# Altium project ERN_MainPower.PrjPcb
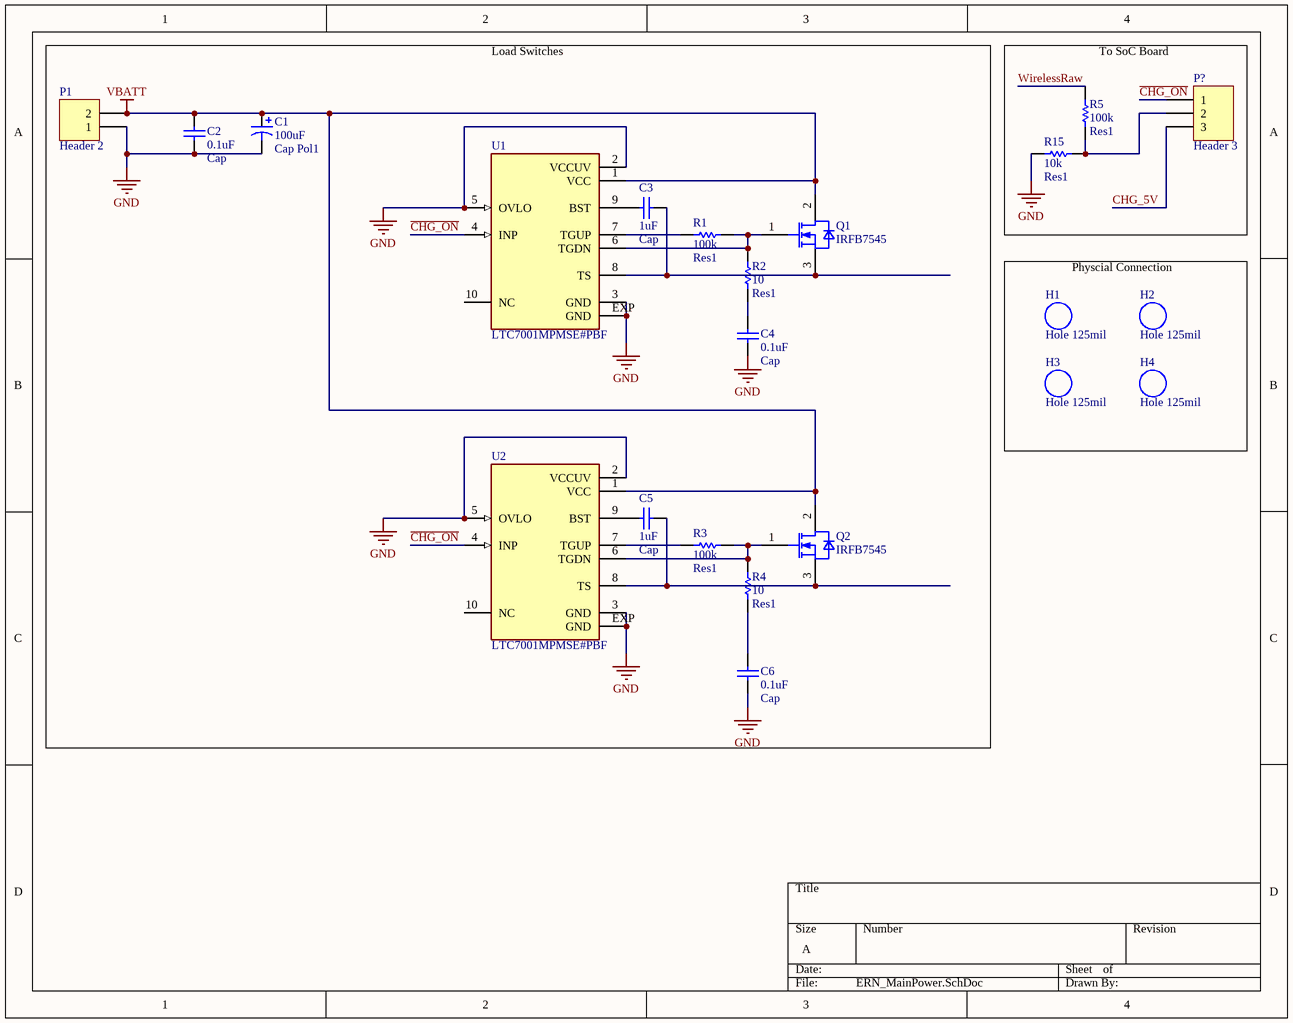
[diagram p0: ERN_MainPower.SchDoc]
2 sheets, 67 parts. Net scope: global (net labels, ports and power ports of the same name join across sheets).
Board file: ERN_MainPower.PcbDoc
Sheets:
  ERN_MainPower.SchDoc
  ERN_MainPower_2.SchDoc

## Sheet ERN_MainPower.SchDoc
size A; SheetNumber: 1; SheetTotal: 2; SPICEModelCachePHLGHTKS: <root> / <DocumentId>PHLGHTKS</DocumentId> / </root>

### Parts
C1  Cap Pol1  value 100uF  [RB7.6-15]
C2  Cap  value 0.1uF  [RAD-0.3]
C3  Cap  value 1uF  [C0805]
C4  Cap  value 0.1uF  [C0805]
C5  Cap  value 1uF  [C0805]
C6  Cap  value 0.1uF  [C0805]
H1  Hole 125mil  [Hole 125mil]
H2  Hole 125mil  [Hole 125mil]
H3  Hole 125mil  [Hole 125mil]
H4  Hole 125mil  [Hole 125mil]
P1  Header 2  [HDR1X2]
P?  Header 3  [HDR1X3]
Q1  IRFB7545  [IFX-PG-TO220-3-904]
Q2  IRFB7545  [IFX-PG-TO220-3-904]
R1  Res1  value 100k  [AXIAL-0.3]
R2  Res1  value 10  [AXIAL-0.3]
R3  Res1  value 100k  [AXIAL-0.3]
R4  Res1  value 10  [AXIAL-0.3]
R5  Res1  value 100k  [AXIAL-0.3]
R15  Res1  value 10k  [AXIAL-0.3]
U1  LTC7001MPMSE#PBF  [SOP50P490X110-11N]
U2  LTC7001MPMSE#PBF  [SOP50P490X110-11N]

### Blocks framed on the sheet
Load Switches: C1-C6 P1 Q1 Q2 R1-R4 U1 U2
To SoC Board: P? R5 R15
Physcial Connection: H1-H4

### Nets
GND: C1.2 C2.1 C4.2 C6.2 P1.1 R15.2 U1.2(VCCUV) U1.3(GND) U1.5(OVLO) U1.EXP(GND) U2.2(VCCUV) U2.3(GND) U2.5(OVLO) U2.EXP(GND)
VBATT: C1.1 C2.2 P1.2 Q1.2(DRAIN) Q2.2(DRAIN) U1.1(VCC) U2.1(VCC)
~{CHG_ON}: P?.1 U1.4(INP) U2.4(INP)
CHG_5V: P?.3
WirelessRaw: R5.1
NetC3_1: C3.1 Q1.3(SOURCE) U1.8(TS)
NetC3_2: C3.2 U1.9(BST)
NetC4_1: C4.1 R2.2
NetC5_1: C5.1 Q2.3(SOURCE) U2.8(TS)
NetC5_2: C5.2 U2.9(BST)
NetC6_1: C6.1 R4.2
NetP?_2: P?.2 R5.2 R15.1
NetQ1_1: Q1.1(GATE) R1.1 R2.1 U1.6(TGDN)
NetQ2_1: Q2.1(GATE) R3.1 R4.1 U2.6(TGDN)
NetR1_2: R1.2 U1.7(TGUP)
NetR3_2: R3.2 U2.7(TGUP)

Not connected (* = marked no-connect by the designer): U1 10(NC); U2 10(NC)

### Library data of the parts
C1 = Cap Pol1: Polarized Capacitor (Radial); Published: 8-Jun-2000; LatestRevisionDate: 17-Jul-2002; LatestRevisionNote: Re-released for DXP Platform.; PackageReference: RB7.6-15; Publisher: Altium Limited; PackageDescription: Polarized Capacitor (Radial); 2 Leads
C2-C6 = Cap: Capacitor; Published: 8-Jun-2000; LatestRevisionDate: 17-Jul-2002; LatestRevisionNote: Re-released for DXP Platform.; PackageReference: RAD-0.3; Publisher: Altium Limited; PackageDescription: Radial Cap, Thru-Hole; 2 Leads; 0.3 in Pin Spacing
P1 = Header 2: Header, 2-Pin; LatestRevisionDate: 17-Jul-2002; LatestRevisionNote: Re-released for DXP Platform.; Publisher: Altium Limited
P? = Header 3: Header, 3-Pin; LatestRevisionDate: 17-Jul-2002; LatestRevisionNote: Re-released for DXP Platform.; Publisher: Altium Limited
Q1 Q2 = IRFB7545: N-Channel 60V 95A; Insulated-Gate Field-Effect Transistor (IGFET), N-Channel, Enhancement, Body Diode, Pin 1 Gate, 2 Drain, 3 Source, 3 Pins; Manufacturer: Infineon Technologies; Manufacturer Order Number: IRFB7545; PackageReference: PG-TO220-3-904
R1-R5 R15 = Res1: Resistor; Published: 8-Jun-2000; LatestRevisionDate: 17-Jul-2002; LatestRevisionNote: Re-released for DXP Platform.; PackageReference: AXIAL-0.3; Publisher: Altium Limited; PackageDescription: Axial Device, Thru-Hole; 2 Leads; 0.3 in Pin Spacing
U1 U2 = LTC7001MPMSE#PBF: Fast 150V High Side NMOS Static Switch Driver; MF: Analog Devices; SnapEDA_Link: https://www.snapeda.com/parts/LTC7001MPMSE%23PBF/Analog+Devices/view-part/?ref=snap; Package: MSOP -10 Analog Devices; Value: *; MP: LTC7001MPMSE#PBF; Check_prices: https://www.snapeda.com/parts/LTC7001MPMSE%23PBF/Analog+Devices/view-part/?ref=eda

## Sheet ERN_MainPower_2.SchDoc
size A; SheetNumber: 2; SheetTotal: 2; SPICEModelCacheXCFOMGVR: <root> / <DocumentId>XCFOMGVR</DocumentId> / <CacheFrame Number="0"> / <Model Name="1n5400" Kind="MDL"> / <Text>*1N5400 MCE / * 50V 3A Si Rectifier pkg:DO-201 1,2 / .MODEL 1N5400 D(IS=2.68E-12 RS=0.00977 N=1.17 TT=1.44E-5 CJO=1.24E-10 / + VJ=0.6 M=0.333 BV=66.6 IBV=1E-5 )</Text> / </Model> / <Model Name="led2" Kind="MDL"> / <Text>*Typ RED,GREEN,YELLOW,AMBER GaAs LED: Vf=2.1V Vr=4V If=40mA trr=3uS / *LED Pinout: 1=A, 2=K / .MODEL LED2 D (IS=93.1P RS=42M N=4.61 BV=4 IBV=10U / + CJO=2.97P VJ=.75 M=.333 TT=4.32U)</Text> / </Model> / <Model Name="diode" Kind="MDL"> / <Text>*Default Diode / *Diode Pinout: A,K / .MODEL DIODE D()</Text> / </Model> / <Model Name="1n5406" Kind="MDL"> / <Text>*1N5406 MCE / *600V 3A Si Rectifier pkg:DO-201 1,2 / .MODEL 1N5406 D(IS=2.68E-12 RS=0.00731 N=1.17 TT=1.44E-5 CJO=1.24E-10 / + VJ=0.6 M=0.333 BV=900 IBV=1E-5 )</Text> / </Model> / </CacheFrame> / </root>
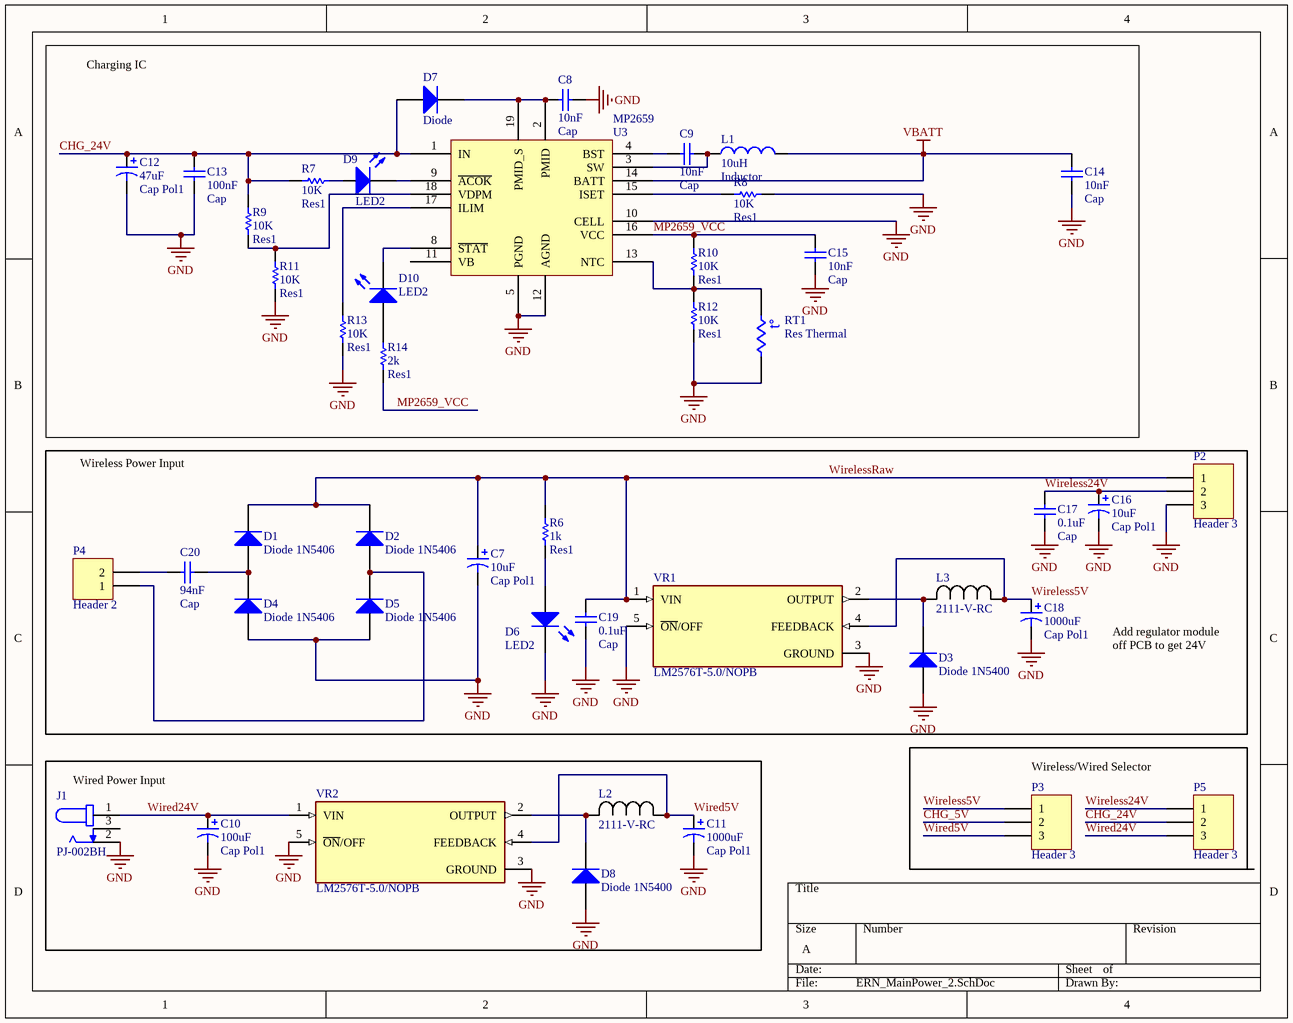
[diagram p1: ERN_MainPower_2.SchDoc]

### Parts
C7  Cap Pol1  value 10uF  [RB7.6-15]
C8  Cap  value 10nF  [C0805]
C9  Cap  value 10nF  [C0805]
C10  Cap Pol1  value 100uF  [RB7.6-15]
C11  Cap Pol1  value 1000uF  [RB7.6-15]
C12  Cap Pol1  value 47uF  [RB7.6-15]
C13  Cap  value 100nF  [RAD-0.3]
C14  Cap  value 10nF  [C0805]
C15  Cap  value 10nF  [C0805]
C16  Cap Pol1  value 10uF  [RB7.6-15]
C17  Cap  value 0.1uF  [RAD-0.3]
C18  Cap Pol1  value 1000uF  [RB7.6-15]
C19  Cap  value 0.1uF  [RAD-0.3]
C20  Cap  value 94nF  [C1210]
D1  Diode 1N5406  [DO-201AD]
D2  Diode 1N5406  [DO-201AD]
D3  Diode 1N5400  [DO-201AD]
D4  Diode 1N5406  [DO-201AD]
D5  Diode 1N5406  [DO-201AD]
D6  LED2  [3.2X1.6X1.1]
D7  Diode  [DIODE_SMC]
D8  Diode 1N5400  [DO-201AD]
D9  LED2  [LED-0]
D10  LED2  [LED-0]
J1  PJ-002BH  [CUI_PJ-002BH]
L1  Inductor  value 10uH  [0402-A]
L2  2111-V-RC  [IND_21XX_27A_V]
L3  2111-V-RC  [IND_21XX_27A_V]
P2  Header 3  [HDR1X3]
P3  Header 3  [HDR1X3]
P4  Header 2  [HDR1X2]
P5  Header 3  [HDR1X3]
R6  Res1  value 1k  [AXIAL-0.3]
R7  Res1  value 10K  [AXIAL-0.3]
R8  Res1  value 10K  [AXIAL-0.3]
R9  Res1  value 10K  [AXIAL-0.3]
R10  Res1  value 10K  [AXIAL-0.3]
R11  Res1  value 10K  [AXIAL-0.3]
R12  Res1  value 10K  [AXIAL-0.3]
R13  Res1  value 10K  [AXIAL-0.3]
R14  Res1  value 2k  [AXIAL-0.3]
RT1  Res Thermal  [AXIAL-0.3]
U3  MP2659  [MP2659_QFN19]
VR1  LM2576T-5.0/NOPB  [TO170P1067X483X1651-5]
VR2  LM2576T-5.0/NOPB  [TO170P1067X483X1651-5]

### Blocks framed on the sheet
Charging IC: C8 C9 C12-C15 D7 D9 D10 L1 R7-R14 RT1 U3
Wired Power Input: C10 C11 D8 J1 L2 VR2

### Nets
GND: C7.2 C8.1 C10.2 C11.2 C12.2 C13.1 C14.2 C15.2 C16.2 C17.2 C18.2 C19.2 D3.1(A) D4.1(A) D5.1(A) D6.2(K) D8.1(A) J1.2 P2.3 R8.2 R11.2 R12.1 R13.2 RT1.2 U3.5(PGND) U3.10(CELL) U3.12(AGND) VR1.3(GROUND) VR1.5(~{ON}/OFF) VR2.3(GROUND) VR2.5(~{ON}/OFF)
VBATT: C14.1 L1.2 U3.14(BATT)
CHG_5V: P3.2
CHG_24V: C12.1 C13.2 D7.1(A) P5.2 R7.2 R9.1 U3.1(IN)
MP2659_VCC: C15.1 R10.2 R14.2 U3.16(VCC)
Wired5V: C11.1 L2.1 P3.3 VR2.4(FEEDBACK)
Wired24V: C10.1 J1.1 P5.3 VR2.1(VIN)
Wireless5V: C18.1 L3.1 P3.1 VR1.4(FEEDBACK)
Wireless24V: C16.1 C17.1 P2.2 P5.1
WirelessRaw: C7.1 C19.1 D1.2(K) D2.2(K) P2.1 R6.2 VR1.1(VIN)
NetC8_2: C8.2 D7.2(K) U3.2(PMID) U3.19(PMID_S)
NetC9_1: C9.1 L1.1 U3.3(SW)
NetC9_2: C9.2 U3.4(BST)
NetC20_1: C20.1 P4.2
NetC20_2: C20.2 D1.1(A) D4.2(K)
NetD2_1: D2.1(A) D5.2(K) P4.1
NetD3_2: D3.2(K) L3.2 VR1.2(OUTPUT)
NetD6_1: D6.1(A) R6.1
NetD8_2: D8.2(K) L2.2 VR2.2(OUTPUT)
NetD9_1: D9.1(A) R7.1
NetD9_2: D9.2(K) U3.9(~{ACOK})
NetD10_1: D10.1(A) R14.1
NetD10_2: D10.2(K) U3.8(~{STAT})
NetR8_1: R8.1 U3.15(ISET)
NetR9_2: R9.2 R11.1 U3.18(VDPM)
NetR10_1: R10.1 R12.2 RT1.1 U3.13(NTC)
NetR13_1: R13.1 U3.17(ILIM)

Not connected (* = marked no-connect by the designer): J1 3; U3 11(VB)

### Notes on the sheet
- Wireless Power Input
- Add regulator module
- off PCB to get 24V
- Wireless/Wired Selector
- (in symbol Res Thermal) t°

### Library data of the parts
C7 C10-C12 C16 C18 = Cap Pol1: Polarized Capacitor (Radial); Published: 8-Jun-2000; LatestRevisionDate: 17-Jul-2002; LatestRevisionNote: Re-released for DXP Platform.; PackageReference: RB7.6-15; Publisher: Altium Limited; PackageDescription: Polarized Capacitor (Radial); 2 Leads
C8 C9 C13-C15 C17 C19 C20 = Cap: Capacitor; Published: 8-Jun-2000; LatestRevisionDate: 17-Jul-2002; LatestRevisionNote: Re-released for DXP Platform.; PackageReference: RAD-0.3; Publisher: Altium Limited; PackageDescription: Radial Cap, Thru-Hole; 2 Leads; 0.3 in Pin Spacing
D1 D2 D4 D5 = Diode 1N5406: 3 Amp General Purpose Rectifier; Published: 8-Jun-2000; LatestRevisionDate: 17-Jul-2002; LatestRevisionNote: Re-released for DXP Platform.; DatasheetVersion: 1998; PackageVersion: Aug-1999; PackageReference: DO-201AD; Publisher: Altium Limited; PackageDescription: Diode, Axial; Body 9.5 x 5.6 mm (LxDia. max), Lead Dia. 1.32 mm (max); ComponentLink1Description: Manufacturer Link; ComponentLink1URL: http://www.fairchildsemi.com/; ComponentLink2Description: Datasheet; ComponentLink2URL: http://www.fairchildsemi.com/ds/1N%2F1N5400.pdf
D3 D8 = Diode 1N5400: 3 Amp General Purpose Rectifier; Published: 8-Jun-2000; LatestRevisionDate: 17-Jul-2002; LatestRevisionNote: Re-released for DXP Platform.; DatasheetVersion: 1998; PackageVersion: Aug-1999; PackageReference: DO-201AD; Publisher: Altium Limited; PackageDescription: Diode, Axial; Body 9.5 x 5.6 mm (LxDia. max), Lead Dia. 1.32 mm (max); ComponentLink1Description: Manufacturer Link; ComponentLink1URL: http://www.fairchildsemi.com/; ComponentLink2Description: Datasheet; ComponentLink2URL: http://www.fairchildsemi.com/ds/1N%2F1N5400.pdf
D6 D9 D10 = LED2: Typical RED, GREEN, YELLOW, AMBER GaAs LED; Published: 8-Jun-2000; LatestRevisionDate: 17-Jul-2002; LatestRevisionNote: Re-released for DXP Platform.; PackageVersion: Feb-2002; PackageReference: 3.2X1.6X1.1; Publisher: Altium Limited; PackageDescription: SM LED; 2 Flat Leads
D7 = Diode: Default Diode; Published: 8-Jun-2000; LatestRevisionDate: 17-Jul-2002; LatestRevisionNote: Re-released for DXP Platform.; PackageVersion: Sep-1996; PackageReference: SMC; Publisher: Altium Limited; PackageDescription: DO-214-AB/SMC; 2 C-Bend Leads; Body 7.9 x 5.9 mm, inc. leads (LxW); Code_JEDEC: DO-214-AB
J1 = PJ-002BH: 2.5 x 6.5 mm, 5.0 A, Horizontal, Through Hole, Dc Power Jack Connector; MF: Same Sky; SnapEDA_Link: https://www.snapeda.com/parts/PJ-002BH/Same+Sky/view-part/?ref=snap; Package: None; Value: *; MP: PJ-002BH; Check_prices: https://www.snapeda.com/parts/PJ-002BH/Same+Sky/view-part/?ref=eda
L1 = Inductor: Code_IEC: 1005; Published: 8-Jun-2000; LatestRevisionDate: 29-May-2009; LatestRevisionNote: IPC-7351 Footprint Added.; PackageReference: 0402-A; Publisher: Altium Limited; PackageDescription: Chip Inductor; Code_JEITA: 0402
L2 L3 = 2111-V-RC: Inductor 68uH; Manufacturer_Name: Bourns Electronics; Copyright: Copyright (C) 2026 Ultra Librarian. All rights reserved.; Manufacturer_Part_Number: 2111-V-RC
P2 P3 P5 = Header 3: Header, 3-Pin; LatestRevisionDate: 17-Jul-2002; LatestRevisionNote: Re-released for DXP Platform.; Publisher: Altium Limited
P4 = Header 2: Header, 2-Pin; LatestRevisionDate: 17-Jul-2002; LatestRevisionNote: Re-released for DXP Platform.; Publisher: Altium Limited
R6-R14 = Res1: Resistor; Published: 8-Jun-2000; LatestRevisionDate: 17-Jul-2002; LatestRevisionNote: Re-released for DXP Platform.; PackageReference: AXIAL-0.3; Publisher: Altium Limited; PackageDescription: Axial Device, Thru-Hole; 2 Leads; 0.3 in Pin Spacing
RT1 = Res Thermal: Thermistor; Published: 24-Mar-1999; LatestRevisionDate: 29-May-2009; LatestRevisionNote: IPC-7351 Footprint Added.; PackageVersion: Mar-2003; PackageReference: 6-0805; Publisher: Altium Limited; PackageDescription: Chip Resistor 0805 Case Size; Code_IPC: RESC2012
U3 = MP2659: 3S-6S Standalone Switching Charger
VR1 VR2 = LM2576T-5.0/NOPB: SIMPLE SWITCHERÂ® 40V, 3A Low Component Count Step-Down Regulator; MF: Texas Instruments; SnapEDA_Link: https://www.snapeda.com/parts/LM2576T-5.0/NOPB/Texas+Instruments/view-part/?ref=snap; Package: TO-220-5 Texas Instruments; Value: *; MP: LM2576T-5.0/NOPB; Check_prices: https://www.snapeda.com/parts/LM2576T-5.0/NOPB/Texas+Instruments/view-part/?ref=eda

## Nets that join several sheets
GND: ERN_MainPower (14 pins), ERN_MainPower_2 (31 pins)
VBATT: ERN_MainPower (7 pins), ERN_MainPower_2 (C14.1 L1.2 U3.14)
CHG_5V: ERN_MainPower (P?.3), ERN_MainPower_2 (P3.2)
WirelessRaw: ERN_MainPower (R5.1), ERN_MainPower_2 (7 pins)